# EAGLE design mech_thonkiconn_breakout (EAGLE 7.6.0)
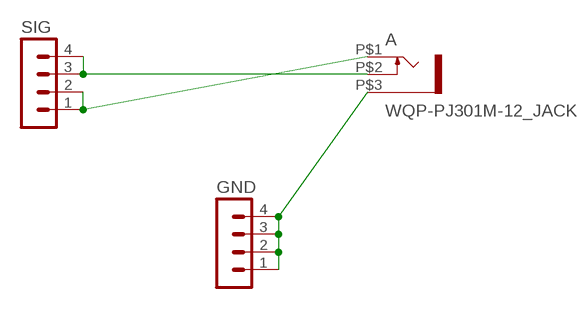
[diagram p0: schematic, sheet 1]

## Parts
A  WQP-PJ301M-12_JACK  [WQP-PJ301M-12_JACK]
GND  MA04-1  [MA04-1]
SIG  MA04-1  [MA04-1]

## Nets
N$1: A.P$1 SIG.1 SIG.2
N$2: A.P$3 GND.1 GND.2 GND.3 GND.4
N$3: A.P$2 SIG.3 SIG.4

## Library data of the parts
A = thonkiconn:WQP-PJ301M-12_JACK
GND SIG = con-lstb:MA04-1: PIN HEADER; OC_FARNELL: unknown; OC_NEWARK: unknown

## Board
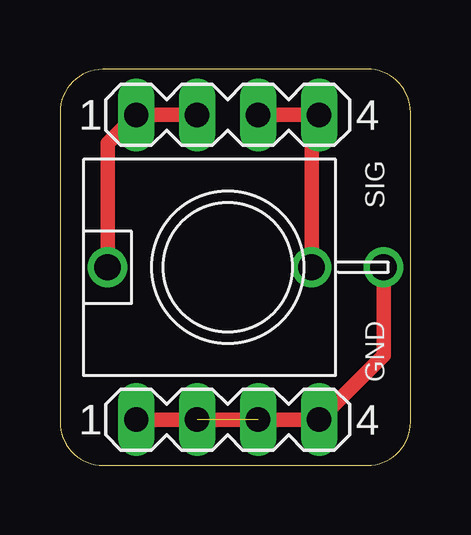
[diagram p1: board, top side]

Size 14.61 x 16.51 mm. Coordinates in mm from the lower left corner, seen from the top.
Outline: 12.81,16.51 1.79,16.5 arc90 0,14.71 0,1.8 arc90 1.8,0 12.81,0 arc90 14.61,1.8 14.61,14.71 arc90 12.81,16.51
Copper layers (1*16): Top 0.035mm / dielectric 1.5mm / Bottom 0.035mm
Design rules "default": minimum track width 10mil, minimum drill 24mil, track to track 8mil, track to pad 8mil, pad to pad 8mil, via to via 8mil, smd to smd 8mil, copper to edge 40mil, drill to drill 8mil, minimum pad ring 10mil, minimum via ring 8mil, stop-mask expansion 4mil, vias tented up to drill 0mil, thermal gap 10mil

### Footprints (pad centres in the part's own frame; a part is rotated, then mirrored left to right if it is on the bottom)
WQP-PJ301M-12_JACK = drill 1.1: P$1 0,5; P$2 0,-3.5; P$3 0,-6.5
MA04-1 = drill 1.016 long: 1 -3.81,0; 2 -1.27,0; 3 1.27,0; 4 3.81,0

### Placement (x,y rotation side)
A  6.98,8.26 90 top
GND  6.98,1.91 0 top
SIG  6.98,14.61 0 top

### Tracks (layer width: path | path; a pad name or v marks a point on that pad's centre or on a via)
N$1
  Top 0.61: A.P$1 1.98,13.41 SIG.1 SIG.2
N$2  (1 unrouted)
  Top 0.61: A.P$3 13.48,4.6 GND.4 GND.3 GND.1
N$3
  Top 0.61: A.P$2 10.48,14.3 SIG.4 SIG.3